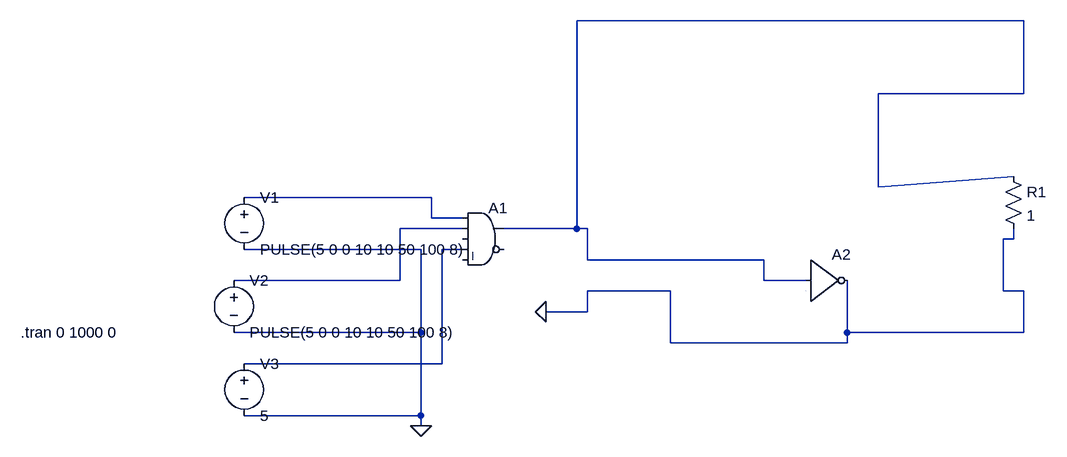
[diagram p0: schematic NAND3.asc]
NAND3.asc, the LTspice schematic file:
Version 4
SHEET 1 1048 680
WIRE 1008 -208 320 -208
WIRE 1008 -96 1008 -208
WIRE 1008 -96 784 -96
WIRE 784 48 784 -96
WIRE 784 48 992 32
WIRE 96 64 -192 64
WIRE 96 96 96 64
WIRE 144 96 96 96
WIRE 144 112 48 112
WIRE 320 112 320 -208
WIRE 320 112 208 112
WIRE 336 112 320 112
WIRE 992 128 992 112
WIRE 992 128 976 128
WIRE 80 144 -192 144
WIRE 144 144 112 144
WIRE 336 160 336 112
WIRE 608 160 336 160
WIRE 48 192 48 112
WIRE 48 192 -208 192
WIRE 608 192 608 160
WIRE 672 192 608 192
WIRE 464 208 336 208
WIRE 976 208 976 128
WIRE 1008 208 976 208
WIRE 336 240 336 208
WIRE 336 240 272 240
WIRE 80 272 80 144
WIRE 80 272 -208 272
WIRE 736 272 736 192
WIRE 1008 272 1008 208
WIRE 1008 272 736 272
WIRE 464 288 464 208
WIRE 736 288 736 272
WIRE 736 288 464 288
WIRE 112 320 112 144
WIRE 112 320 -192 320
WIRE 80 400 80 272
WIRE 80 400 -192 400
WIRE 80 416 80 400
FLAG 272 240 0
FLAG 80 416 0
SYMBOL Digital\\and 176 64 R0
SYMATTR InstName A1
SYMBOL voltage -192 48 R0
WINDOW 123 0 0 Left 0
WINDOW 39 0 0 Left 0
SYMATTR InstName V1
SYMATTR Value PULSE(5 0 0 10 10 50 100 8)
SYMBOL voltage -208 176 R0
WINDOW 123 0 0 Left 0
WINDOW 39 0 0 Left 0
SYMATTR InstName V2
SYMATTR Value PULSE(5 0 0 10 10 50 100 8)
SYMBOL voltage -192 304 R0
WINDOW 123 0 0 Left 0
WINDOW 39 0 0 Left 0
SYMATTR InstName V3
SYMATTR Value 5
SYMBOL Digital\\inv 672 128 R0
SYMATTR InstName A2
SYMBOL res 976 16 R0
SYMATTR InstName R1
SYMATTR Value 1
TEXT -536 272 Left 2 !.tran 0 1000 0

The netlist it stands for:
* NAND3.asc
A1 N002 N003 0 N004 0 0 N001 0 AND
V1 N002 0 PULSE(5 0 0 10 10 50 100 8)
V2 N003 0 PULSE(5 0 0 10 10 50 100 8)
V3 N004 0 5
A2 N001 0 0 0 0 0 0 0 BUF
R1 N001 0 1
.tran 0 1000 0
.backanno
.end